# EAGLE design just_a_switch-mk-1 (EAGLE 6.5.0)
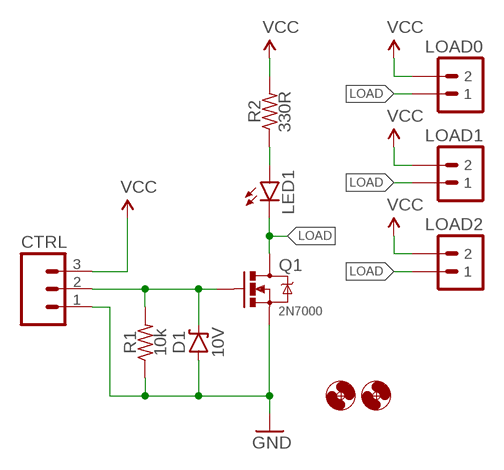
[diagram p0: schematic, sheet 1]

## Parts
CTRL  M03PTH  [1X03]
D1  10V  DIODE-ZENERPTH-7.62MM  [DIODE-7.62MM]
H1  HOLE#2  [HOLE-#2]
H2  HOLE#2  [HOLE-#2]
LED1  LED3MM  [LED3MM]
LOAD0  M02PTH-2MM  [1X02-2MM-PTH]
LOAD1  M021X02_NO_SILK  [1X02_NO_SILK]
LOAD2  M023.5MM  [SCREWTERMINAL-3.5MM-2]
Q1  2N7000  MOSFET-NCHANNEL2N7000-AMMO  [TO-92-AMMO]
R1  10k  RESISTORPTH-AXIAL-7.62MM  [RESISTOR-AXIAL-PTH-7.62MM]
R2  330R  RESISTORPTH-AXIAL-7.62MM  [RESISTOR-AXIAL-PTH-7.62MM]

## Nets
GND: CTRL.1 D1.A Q1.1(S) R1.P$1
LOAD: LED1.K(C) LOAD0.P$1 LOAD1.1 LOAD2.1 Q1.3(D)
N$1: CTRL.2 D1.K(C) Q1.2(G) R1.P$2
N$2: LED1.A R2.P$1
VCC: CTRL.3 LOAD0.P$2 LOAD1.2 LOAD2.2 R2.P$2

## Library data of the parts
CTRL = A_butts:M03: Header 3 Standard 3-pin 0.1" header. Use with straight break away headers (SKU : PRT-00116), right angle break away headers (PRT-00553), swiss pins (PRT-00743), machine pins (PRT-00117), and female headers (PRT-00115). Molex polarized connector foot print use with SKU : PRT-08232 with associated crimp pins and housings.
D1 = A_butts:DIODE-ZENER: Zener Diode Production Part - 8199 3.4V Zener Voltage
H1 H2 = A_butts:HOLE: MOUNTING HOLE with drill center marker
LED1 = A_butts:LED: LEDs Standard schematic elements and footprints for 5mm, 3mm, 1206, and 0603 sized LEDs. 5mm - Spark Fun Electronics SKU : COM-00529 (and others)
LOAD0 LOAD1 LOAD2 = A_butts:M02: Standard 2-pin 0.1" header. Use with - straight break away headers ( PRT-00116) - right angle break away headers (PRT-00553) - swiss pins (PRT-00743) - machine pins (PRT-00117) - female headers (PRT-00115) Molex polarized connector foot print use with: PRT-08233 with associated crimp pins and housings. 2.54_SCREWTERM for use with PRT-10571. 3.5mm Screw Terminal footprints for PRT-08084 5mm Screw Terminal footprints for use with PRT-08433
Q1 = A_butts:MOSFET-NCHANNEL: Common NMOSFET Parts MFG P/N Store ID Prod ID FDD8780 TRANS-09984 SI7820DN TRANS-11055 FDS6630A IC-08089 2N7002PW TRANS-11151 FQP30N06L COM-10213 TRANS-10060 BSS123LT1G TRANS-08345 BSS138 TRANS-00830 BS170 2N7000
R1 R2 = A_butts:RESISTOR: RESISTOR, American symbol

## Board
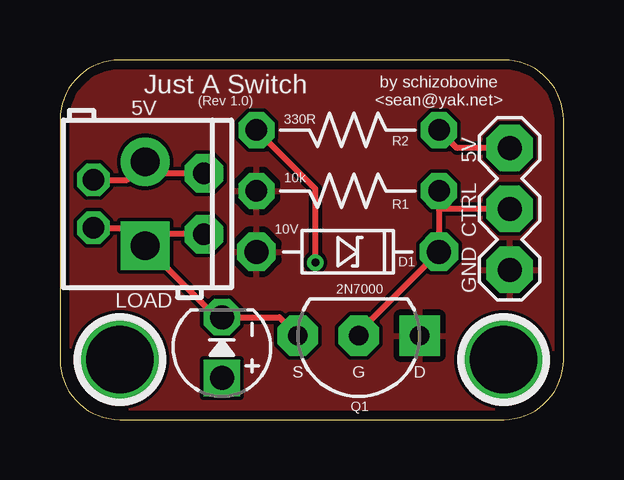
[diagram p1: board, top side]
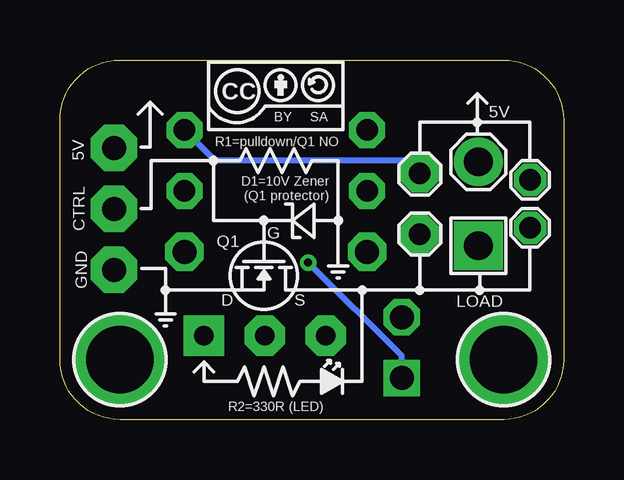
[diagram p2: board, bottom side, seen from below]

Size 21 x 15 mm. Coordinates in mm from the lower left corner, seen from the top.
Outline: 2.5,0 18.5,0 arc90 21,2.5 21,12.5 arc90 18.5,15 2.5,15 arc90 0,12.5 0,2.5 arc90 2.5,0
Copper layers (1*16): Top 0.0356mm / dielectric 1.5011mm / Bottom 0.0356mm
Design rules "LaenPCBOrder_2": minimum track width 6mil, minimum drill 13mil, track to track 6mil, track to pad 6mil, pad to pad 6mil, via to via 6mil, smd to smd 6mil, copper to edge 15mil, drill to drill 6mil, minimum pad ring 7mil, minimum via ring 7mil, stop-mask expansion 3mil, vias tented up to drill 20mil, thermal gap 10mil

### Footprints (pad centres in the part's own frame; a part is rotated, then mirrored left to right if it is on the bottom)
1X03 = drill 1 pad 1.93 octagon: 1 0,0; 2 2.54,0; 3 5.08,0
DIODE-7.62MM = drill 1 pad 1.6 octagon: A -3.81,0; K 3.81,0
HOLE-#2 = drill 2.8 pad 3.81: P$1 0,0
LED3MM = drill 1 pad 1.524 square: A -1.27,0 | drill 1 pad 1.524 octagon: K 1.27,0
1X02-2MM-PTH = drill 0.9 octagon: P$1 -1,0; P$2 1,0
1X02_NO_SILK = drill 0.9 pad 1.6 octagon: 1 0,0; 2 2.54,0
SCREWTERMINAL-3.5MM-2 = drill 1.2 pad 2.032 square: 1 0,0 | drill 1.2 pad 2.032: 2 3.5,0
TO-92-AMMO = drill 0.813 pad 1.676 square: 1 -2.54,0 | drill 0.813 pad 1.676 octagon: 2 0,0; 3 2.54,0
RESISTOR-AXIAL-PTH-7.62MM = drill 0.9 pad 1.5 octagon: P$1 -3.81,0; P$2 3.81,0

### Placement (x,y rotation side)
CTRL  18.75,6.25 90 top
D1  12,7 0 top
H1  2.5,2.5 180 top
H2  18.5,2.5 180 top
LED1  6.75,3 90 top
LOAD0  1.4,9 90 top
LOAD1  6,7.73 90 top
LOAD2  3.55,7.25 90 top
Q1  12.46,3.5 180 top
R1  12,9.54 0 top
R2  12,12.08 0 top
U$1  [CC-BY-SA-4.0-NO-URL]  12,13.5 0 bottom

### Tracks (layer width: path | path; a pad name or v marks a point on that pad's centre or on a via)
GND
  pour Top: 0,2.5 0,12.5 arc-90 2.5,15 18.5,15 arc-90 21,12.5 21,2.5 arc-90 18.5,0 2.5,0 arc-90
LOAD
  Top 0.25: LOAD2.1 6.53,4.27 LED1.K 9.15,4.27 Q1.3 | LOAD0.P$1 2.8,8 LOAD2.1 | LOAD1.1 4.03,7.73 LOAD2.1
N$1
  Top 0.25: R1.P$2 15.81,8.75 | 15.81,8.75 D1.K 12.46,3.65 Q1.2 | CTRL.2 15.85,8.79 15.81,8.75
N$2  (via drill 0.33)
  Top 0.25: v10.65,6.55 10.65,9.62 R2.P$1
  Bottom 0.25: LED1.A 6.75,2.65 v10.65,6.55
VCC
  Top 0.25: LOAD1.2 4.03,10.27 LOAD2.2 2.8,10 LOAD0.P$2 | CTRL.3 16.56,11.33 R2.P$2
  Bottom 0.25: LOAD1.2 6.54,10.81 14.54,10.81 R2.P$2

### Text on the board
tPlace: (Rev 1.0) | Just A Switch | by schizobovine / <sean@yak.net> | S | G | D
bPlace: R1=pulldown/Q1 NO | D1=10V Zener / (Q1 protector) | G | Q1 | S | D | R2=330R (LED)
tNames: 5V | 5V | CTRL | GND | LOAD
bNames: 5V | 5V | CTRL | GND | LOAD